# EAGLE design ACS_5.4 (EAGLE 9.6.2)
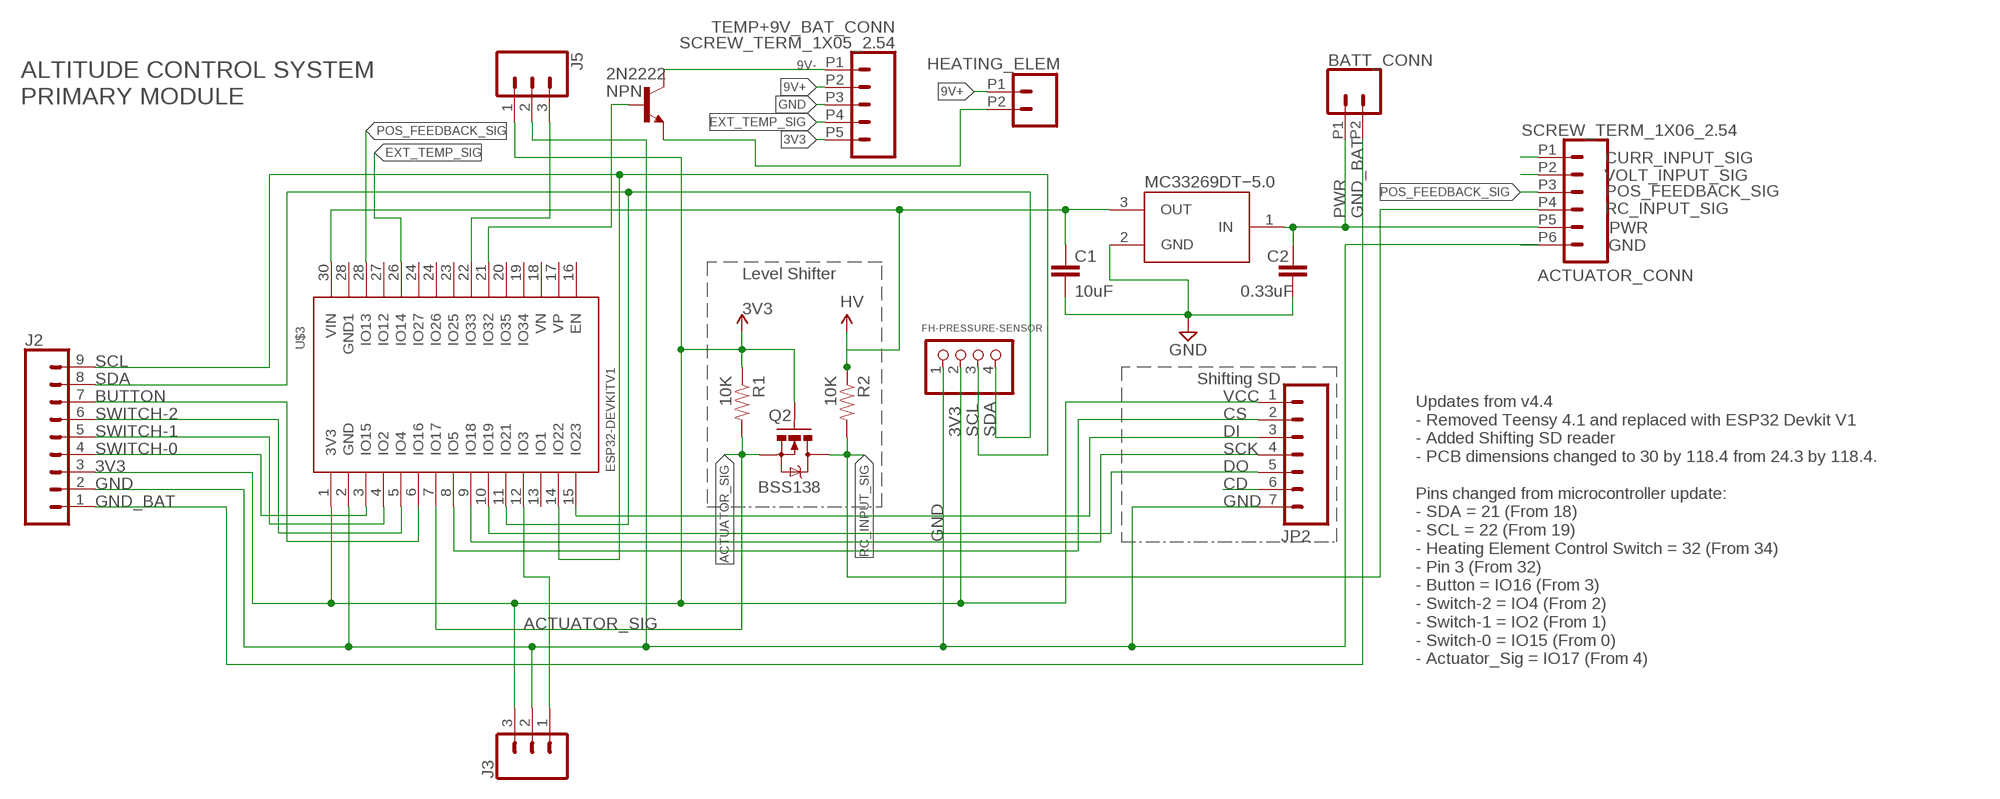
[diagram p0: schematic, sheet 1]

## Parts
2N2222  NPN  NPN_SOT23  [SOT95P237X112-3N]
ACTUATOR_CONN  SCREW_TERM_1X06_2.54  [1X06_2.54_SCREWTERM]
BATT_CONN  CONN_022.54MM_SCREWTERM  [1X02_2.54_SCREWTERM]
C1  10uF  C_CHIP-0603(1608-METRIC)  [CAPC1608X85]
C2  0.33uF  C_CHIP-0603(1608-METRIC)  [CAPC1608X85]
FH-PRESSURE-SENSOR  PINHD-1X4  [1X04]
HEATING_ELEM  CONN_022.54MM_SCREWTERM  [1X02_2.54_SCREWTERM]
J2  CONN_09  [1X09]
J3  CONN_03  [1X03]
J5  CONN_03  [1X03]
JP2  M07  [1X07]
Q2  BSS138  MOSFET-NCHANNELSMD  [SOT23-3]
R1  10K  RESISTOR0603-RES  [0603-RES]
R2  10K  RESISTOR0603-RES  [0603-RES]
TEMP+9V_BAT_CONN  SCREW_TERM_1X05_2.54  [1X05_2.54_SCREWTERM]
U1  MC78M05BDTRKG  [MC78M05BDTRKG]
U$3  ESP32DEVKITV1  [ESP32-DEVKITV1]

## Nets
3V3: FH-PRESSURE-SENSOR.2 J2.3 J3.3 J5.1 JP2.1 Q2.1(G) R1.1 TEMP+9V_BAT_CONN.P5 U$3.1(3V3) ; supply symbol labelled LV
9V+: HEATING_ELEM.P1 TEMP+9V_BAT_CONN.P2
9V-: 2N2222.3(C) TEMP+9V_BAT_CONN.P1
ACTUATOR_SIG: Q2.2(S) R1.2 U$3.7(IO17)
BUTTON: J2.7 U$3.6(IO16)
CURR_INPUT_SIG: ACTUATOR_CONN.P1
EXT_TEMP_SIG: TEMP+9V_BAT_CONN.P4 U$3.26(IO14)
GND: ACTUATOR_CONN.P6 C1.2 C2.2 FH-PRESSURE-SENSOR.1 J2.2 J3.2 J5.2 JP2.7 TEMP+9V_BAT_CONN.P3 U1.2(GND) U$3.2(GND)
GND_BAT: BATT_CONN.P2 J2.1
HV: C1.1 R2.1 U1.3(OUT) U$3.30(VIN)
N$1: J5.3 U$3.22(IO33)
N$5: 2N2222.2(B) U$3.21(IO32)
N$8: JP2.6
N$10: J3.1 U$3.12(IO3)
N$11: JP2.3 U$3.15(IO23)
N$12: JP2.2 U$3.8(IO5)
N$13: JP2.4 U$3.9(IO18)
N$14: JP2.5 U$3.10(IO19)
N$16: 2N2222.1(E) HEATING_ELEM.P2
POS_FEEDBACK_SIG: ACTUATOR_CONN.P3 U$3.28(IO13)
PWR: ACTUATOR_CONN.P5 BATT_CONN.P1 C2.1 U1.1(IN)
RC_INPUT_SIG: ACTUATOR_CONN.P4 Q2.3(D) R2.2
SCL: FH-PRESSURE-SENSOR.3 J2.9 U$3.14(IO22)
SDA: FH-PRESSURE-SENSOR.4 J2.8 U$3.11(IO21)
SWITCH-0: J2.4 U$3.3(IO15)
SWITCH-1: J2.5 U$3.4(IO2)
SWITCH-2: J2.6 U$3.5(IO4)
VOLT_INPUT_SIG: ACTUATOR_CONN.P2
Unconnected: U$3.13(IO1) U$3.16(EN) U$3.17(VP) U$3.18(VN) U$3.19(IO34) U$3.20(IO35) U$3.23(IO25) U$3.24(IO26) U$3.24(IO27) U$3.27(IO12) U$3.28(GND1)

## Notes on the sheet
- Heating Element 
  Control Switch
- ALTITUDE CONTROL SYSTEM
  PRIMARY MODULE
- Actuator Voltage: 7.5 MAX
- MC33269DT−5.0
- Level Shifter
- Shifting SD
- VCC
- CS
- DI
- SCK
- DO
- CD
- Updates from v4.4
  - Removed Teensy 4.1 and replaced with ESP32 Devkit V1
  - Added Shifting SD reader
  - PCB dimensions changed to 30 by 118.4 from 24.3 by 118.4.
  
  Pins changed from microcontroller update:
  - SDA = 21 (From 18)
  - SCL = 22 (From 19)
  - Heating Element Control Switch = 32 (From 34)
  - Pin 3 (From 32)
  - Button = IO16 (From 3)
  - Switch-2 = IO4 (From 2)
  - Switch-1 = IO2 (From 1)
  - Switch-0 = IO15 (From 0)
  - Actuator_Sig = IO17 (From 4)

## Library data of the parts
2N2222 = Transistor:NPN: NPN - Generic; CATEGORY: Transistor; SUB-CATEGORY: BJT; TYPE: NPN
ACTUATOR_CONN = Connectors-Terminal_Block:SCREW_TERM_1X06_2.54
BATT_CONN HEATING_ELEM = SparkFun-Connectors:CONN_02: Multi connection point. Often used as Generic Header-pin footprint for 0.1 inch spaced/style header connections On any of the 0.1 inch spaced packages, you can populate with these: Break Away Headers - Straight <https://www.sparkfun.com/products/116> (PRT-00116) Break Away Male Headers - Right Angle <https://www.sparkfun.com/products/553> (PRT-00553) Female Headers <https://www.sparkfun.com/products/115> (PRT-00115) Break Away Headers - Machine Pin <https://www.sparkfun.com/products/117> (PRT-00117) Break Away Female Headers - Swiss Machine Pin <https://www.sparkfun.com/products/743> (PRT-00743) For SCREWTERMINALS and SPRING TERMINALS visit here: Screw Terimnals on SparkFun.com <https://www.sparkfun.com/search/results?term=Screw+Terminals> (5mm/3.5mm/2.54mm spacing) This device is also useful as a general connection point to wire up your design to another part of your project. Our various solder wires solder well into these plated through hole pads. Hook-Up Wire - Assortment (Stranded, 22 AWG) <https://www.sparkfun.com/products/11375> (PRT-11375) Hook-Up Wire - Assortment (Solid Core, 22 AWG) <https://www.sparkfun.com/products/11367> (PRT-11367) View the entire wire category on our website here <https://www.sparkfun.com/categories/141> Special notes: Molex polarized connector foot print use with: PRT-08233 with associated crimp pins and housings. 2.54_SCREWTERM for use with PRT-10571. 3.5mm Screw Terminal footprints for PRT-08084 5mm Screw Terminal footprints for use with PRT-08432
C1 C2 = Capacitor:C: Capacitor - Generic; CATEGORY: Capacitor
FH-PRESSURE-SENSOR = pinhead:PINHD-1X4: PIN HEADER
J2 = SparkFun-Connectors:CONN_09: Multi connection point. Often used as Generic Header-pin footprint for 0.1 inch spaced/style header connections On any of the 0.1 inch spaced packages, you can populate with these: Break Away Headers - Straight <https://www.sparkfun.com/products/116> (PRT-00116) Break Away Male Headers - Right Angle <https://www.sparkfun.com/products/553> (PRT-00553) Female Headers <https://www.sparkfun.com/products/115> (PRT-00115) Break Away Headers - Machine Pin <https://www.sparkfun.com/products/117> (PRT-00117) Break Away Female Headers - Swiss Machine Pin <https://www.sparkfun.com/products/743> (PRT-00743) For SCREWTERMINALS and SPRING TERMINALS visit here: Screw Terimnals on SparkFun.com <https://www.sparkfun.com/search/results?term=Screw+Terminals> (5mm/3.5mm/2.54mm spacing) This device is also useful as a general connection point to wire up your design to another part of your project. Our various solder wires solder well into these plated through hole pads. Hook-Up Wire - Assortment (Stranded, 22 AWG) <https://www.sparkfun.com/products/11375> (PRT-11375) Hook-Up Wire - Assortment (Solid Core, 22 AWG) <https://www.sparkfun.com/products/11367> (PRT-11367) View the entire wire category on our website here <https://www.sparkfun.com/categories/141> Special notes: Molex polarized connector foot print use with SKU : PRT-08231 with associated crimp pins and housings. 1MM SMD Version SKU: PRT-10208 NOTES ON THE VARIANTS LOCK and LOCK_LONGPADS... This footprint was designed to help hold the alignment of a through-hole component (i.e. 6-pin header) while soldering it into place. You may notice that each hole has been shifted either up or down by 0.005 of an inch from it's more standard position (which is a perfectly straight line). This slight alteration caused the pins (the squares in the middle) to touch the edges of the holes. Because they are alternating, it causes a "brace" to hold the component in place. 0.005 has proven to be the perfect amount of "off-center" position when using our standard breakaway headers. Although looks a little odd when you look at the bare footprint, once you have a header in there, the alteration is very hard to notice. Also,if you push a header all the way into place, it is covered up entirely on the bottom side.
J3 J5 = SparkFun-Connectors:CONN_03: Multi connection point. Often used as Generic Header-pin footprint for 0.1 inch spaced/style header connections On any of the 0.1 inch spaced packages, you can populate with these: Break Away Headers - Straight <https://www.sparkfun.com/products/116> (PRT-00116) Break Away Male Headers - Right Angle <https://www.sparkfun.com/products/553> (PRT-00553) Female Headers <https://www.sparkfun.com/products/115> (PRT-00115) Break Away Headers - Machine Pin <https://www.sparkfun.com/products/117> (PRT-00117) Break Away Female Headers - Swiss Machine Pin <https://www.sparkfun.com/products/743> (PRT-00743) Stackable Header - 3 Pin (Female, 0.1") <https://www.sparkfun.com/products/13875> (PRT-13875) For SCREWTERMINALS and SPRING TERMINALS visit here: Screw Terimnals on SparkFun.com <https://www.sparkfun.com/search/results?term=Screw+Terminals> (5mm/3.5mm/2.54mm spacing) This device is also useful as a general connection point to wire up your design to another part of your project. Our various solder wires solder well into these plated through hole pads. Hook-Up Wire - Assortment (Stranded, 22 AWG) <https://www.sparkfun.com/products/11375> (PRT-11375) Hook-Up Wire - Assortment (Solid Core, 22 AWG) <https://www.sparkfun.com/products/11367> (PRT-11367) View the entire wire category on our website here <https://www.sparkfun.com/categories/141> Special notes: Molex polarized connector foot print use with SKU : PRT-08232 with associated crimp pins and housings.
JP2 = SparkFun-Connectors:M07: Header 7 Standard 7-pin 0.1" header. Use with straight break away headers (SKU : PRT-00116), right angle break away headers (PRT-00553), swiss pins (PRT-00743), machine pins (PRT-00117), and female headers (PRT-00115). NOTES ON THE VARIANTS LOCK and LOCK_LONGPADS... This footprint was designed to help hold the alignment of a through-hole component (i.e. 7-pin header) while soldering it into place. You may notice that each hole has been shifted either up or down by 0.005 of an inch from it's more standard position (which is usually a perfectly straight line). This slight alteration caused the pins (the squares in the middle) to touch the edges of the holes. Because they are alternating, it causes a "brace" to hold the header in place. 0.005 has proven to be the perfect amount of "off-center" position when using our standard breakaway headers. Although looks a little odd when you look at the bare footprint, once you have a header in there, the alteration is very hard to notice. Also, if you push a header all the way into place, it is covered up entirely on the bottom side. This idea of altering the position of holes to aid alignment will be further integrated into the Sparkfun Library for other footprints. It can help hold any component with 3 or more connection pins.
Q2 = SparkFun:MOSFET-NCHANNEL
R1 R2 = SparkFun:RESISTOR: Resistor Basic schematic elements and footprints for 0603, 1206, and PTH resistors.
TEMP+9V_BAT_CONN = Connectors-Terminal_Block:SCREW_TERM_1X05_2.54
U1 = LDO:MC78M05BDTRKG: IC REG LINEAR 5V 500MA DPAK Manufacturer's datasheet <https://www.onsemi.cn/PowerSolutions/document/MC78M00-D.PDF>; CREATED_BY: PCBLayout.com; DIGIKEY_PN: MC78M05BDTRKGOSCT-ND; MANUFACTURER: ON Semiconductor; MPN: IC REG LINEAR 5V 500MA DPAK; PACKAGE: DPak
U$3 = ESP32-DEVKITV1:ESP32DEVKITV1

## Board
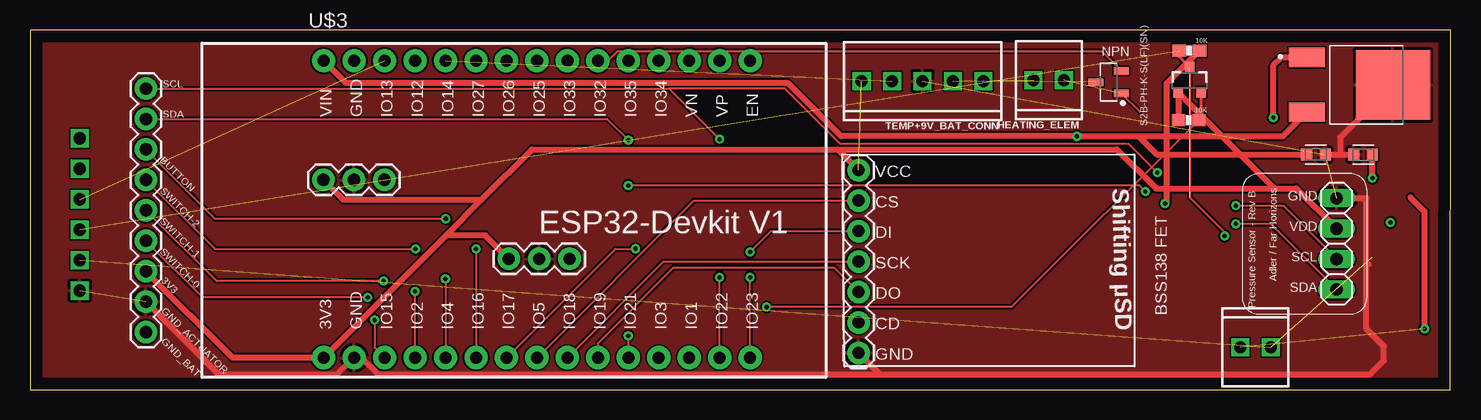
[diagram p1: board, top side]
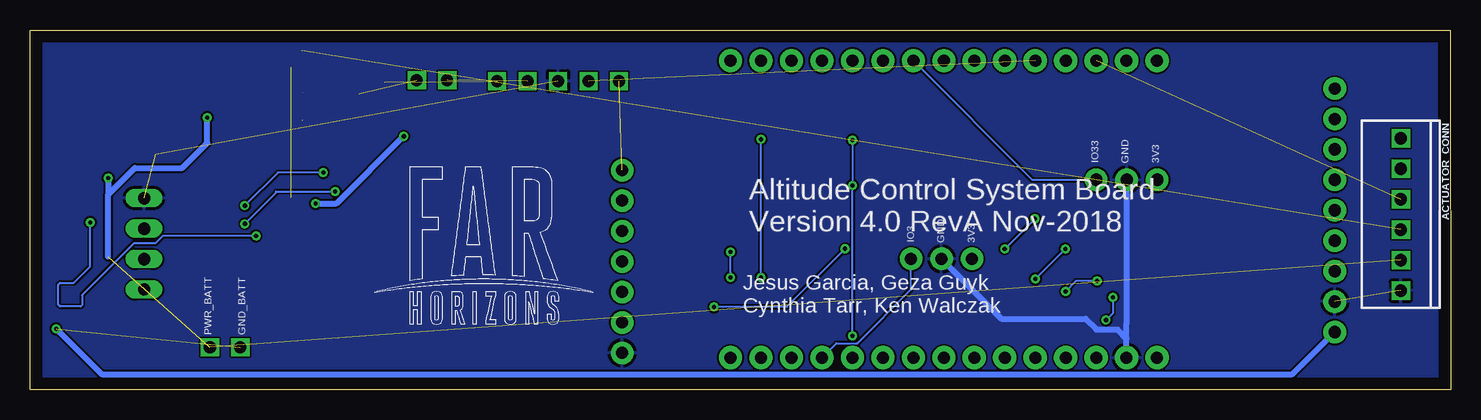
[diagram p2: board, bottom side, seen from below]

Size 118.43 x 30 mm. Coordinates in mm from the lower left corner, seen from the top.
Outline: 0,0 118.4,0 118.43,30 0.03,30 0,0
Copper layers (1*16): Top 0.035mm / dielectric 1.5mm / Bottom 0.035mm
Design rules "default": minimum track width 6mil, minimum drill 0.35mm, track to track 6mil, track to pad 6mil, pad to pad 6mil, via to via 6mil, smd to smd 6mil, copper to edge 40mil, drill to drill 6mil, minimum pad ring 10mil, minimum via ring 8mil, stop-mask expansion 4mil, vias tented up to drill 0mil, thermal gap 10mil

### Footprints (pad centres in the part's own frame; a part is rotated, then mirrored left to right if it is on the bottom)
SOT95P237X112-3N = smd 1.224 x 0.625: 1 -1.064,0.95; 2 -1.064,-0.95; 3 1.064,0
1X06_2.54_SCREWTERM = drill 1.016 square: P1 0,0; P2 2.54,0; P3 5.08,0; P4 7.62,0; P5 10.16,0; P6 12.7,0
1X02_2.54_SCREWTERM = drill 1.016 square: P1 2.54,0; P2 0,0
CAPC1608X85 = smd 0.921 x 0.97: 1 -0.775,0; 2 0.775,0
1X04 = drill 1.016 long: 1 -3.81,0; 2 -1.27,0; 3 1.27,0; 4 3.81,0
1X09 = drill 1.016 pad 1.88: 1 0,0; 2 2.54,0; 3 5.08,0; 4 7.62,0; 5 10.16,0; 6 12.7,0; 7 15.24,0; 8 17.78,0; 9 20.32,0
1X03 = drill 1.016 pad 1.88: 1 0,0; 2 2.54,0; 3 5.08,0
1X07 = drill 1.016 pad 1.88: 1 0,0; 2 2.54,0; 3 5.08,0; 4 7.62,0; 5 10.16,0; 6 12.7,0; 7 15.24,0
SOT23-3 = smd 0.8 x 0.9: 1 -0.95,-1; 2 0.95,-1; 3 0,1.1
0603-RES = smd 1.1 x 1: 1 -0.85,0; 2 0.85,0
1X05_2.54_SCREWTERM = drill 1.016 square: P1 0,0; P2 2.54,0; P3 5.08,0; P4 7.62,0; P5 10.16,0
MC78M05BDTRKG = smd 1.6 x 3: 1 -2.285,-4.08; 3 2.285,-4.08 | smd 5.8 x 6.2: 2 0,3.1
ESP32-DEVKITV1 = drill 1 pad 1.93: 1 -22.87,-13.54; 2 -20.33,-13.54; 3 -17.79,-13.54; 4 -15.25,-13.54; 5 -12.71,-13.54; 6 -10.17,-13.54; 7 -7.63,-13.54; 8 -5.09,-13.54; 9 -2.55,-13.54; 10 -0.01,-13.54; 11 2.53,-13.54; 12 5.07,-13.54; 13 7.61,-13.54; 14 10.15,-13.54; 15 12.69,-13.54; 16 12.69,11.23; 17 10.15,11.23; 18 7.61,11.23; 19 5.07,11.23; 20 2.53,11.23; 21 -0.01,11.23; 22 -2.55,11.23; 23 -5.09,11.23; 24 -7.63,11.23; 25 -10.17,11.23; 26 -12.71,11.23; 27 -15.25,11.23; 28 -17.79,11.23; 29 -20.33,11.23; 30 -22.87,11.23

### Placement (x,y rotation side)
2N2222  89.92,25.64 180 top
ACTUATOR_CONN  4.15,20.95 270 bottom
BATT_CONN  100.9,3.53 0 top
C1  107.19,19.61 0 top
C2  111.13,19.6 180 top
FH-PRESSURE-SENSOR  108.92,12.15 270 top
HEATING_ELEM  86.19,25.81 180 top
J2  9.66,4.79 90 top
J3  44.98,10.9 180 top
J5  24.46,17.5 0 top
JP2  69.07,18.3 270 top
Q2  96.67,25.79 0 top
R1  96.58,22.48 0 top
R2  96.64,28.28 180 top
TEMP+9V_BAT_CONN  79.48,25.73 180 top
U1  110.51,25.42 270 top
U$3  47.34,16.2 0 top

### Tracks (layer width: path | path; a pad name or v marks a point on that pad's centre or on a via)
3V3  (3 unrouted)
  Top 0.152: R1.1
  Top 0.254: 95.7,24.81 Q2.1
  Top 0.508: J2.3 16.88,2.65 U$3.1 34.67,12.86 | 34.67,12.86 37.66,15.85 | 37.66,15.85 41.84,20.03 67.34,20.03 | JP2.1 67.34,20.03 | 67.34,20.03 90.6,20.03 93.84,16.79 93.84,16.78 103.72,16.78 | 103.72,16.78 105.56,16.78 FH-PRESSURE-SENSOR.2 | R1.1 | 95.71,24.78 95.71,22.49 | J5.1 26.11,15.85 37.66,15.85 | J3.3 37.94,12.86 34.67,12.86 | 103.72,16.78 95.7,24.81
9V+  (1 unrouted)
9V-  (1 unrouted)
ACTUATOR_SIG  (via drill 0.35)
  Top 0.152: 97.5,22.55 R1.2 81.83,6.88 v61.41,6.88 | U$3.7 48.8,11.75 v50.48,11.75
  Top 0.254: Q2.2 97.62,22.67 97.5,22.55
  Bottom 0.152: v50.48,11.75 55.35,6.88 v61.41,6.88
BUTTON  (via drill 0.35)
  Top 0.152: v37.17,11.74 U$3.6 | v34.66,14.25 15.44,14.25 J2.7
  Bottom 0.152: v34.66,14.25 v37.17,11.74
EXT_TEMP_SIG  (1 unrouted)
GND  (3 unrouted)
  Top 0.508: C1.2 109.22,19.61 | 109.22,19.61 110.34,19.61 C2.2 | 109.22,19.61 109.22,21.03 U1.2 | J2.2 15.73,1.27 25.62,1.27 U$3.2 27.61,2.67 29.01,1.27 70.86,1.27 | 70.86,1.27 111.7,1.27 112.86,2.43 112.86,3.6 111.4,5.06 111.4,10.61 | JP2.7 70.86,1.27 | 111.56,10.45 111.4,10.61 | 111.4,10.61 111.4,15.95 111.39,15.96 FH-PRESSURE-SENSOR.1
  Bottom 0.508: U$3.2 27.02,4.25 | 27.02,4.25 27.02,5.51 27,5.53 J5.2 | J3.2 37.43,5.9 30.44,5.9 29.55,5.01 27.77,5.01 27.02,4.25
  pour Top: -4.15,31.64 -4.15,-1.81 119.4,-1.81 119.4,31.64
  pour Bottom: -5.76,31.6 -5.76,-1.75 119.61,-1.75 119.61,31.6
GND_BAT  (via drill 0.35)  (1 unrouted)
  Top 0.508: 115.07,16.04 116.25,14.86 v116.25,5.07 v116.25,5.06
  Bottom 0.508: v116.25,5.06 112.46,1.27 13.18,1.27 J2.1
HV  (via drill 0.35)
  Top 0.508: 24.48,27.43 26.31,25.6 63.13,25.6 67.61,21.13 v87.27,21.13 92.41,21.13 | 24.48,27.43 | U$3.30 24.48,27.43 | v94.62,15.52 94.75,15.65 94.75,25.53 R2.1 | 92.41,21.13 93.93,19.61 C1.1 | 92.41,21.13 104.42,21.13 U1.3
  Bottom 0.508: v94.62,15.52 92.88,15.52 v87.27,21.13
N$1
  Bottom 0.152: J5.3 34.86,17.5 U$3.22
N$5
  Top 0.152: U$3.21 48.19,27.43 48.97,28.22 89.36,28.22 2N2222.2
N$10
  Bottom 0.152: U$3.12 51.22,3.86 49.46,3.86 44.98,8.35 J3.1
N$11  (via drill 0.35)
  Top 0.152: U$3.15 v60.03,9.35 | v60.03,11.48 61.77,13.22 JP2.3
  Bottom 0.152: v60.03,9.35 v60.03,11.48
N$12
  Top 0.152: U$3.8 55.35,15.76 JP2.2
N$13
  Top 0.152: U$3.9 52.81,10.68 JP2.4
N$14
  Top 0.152: U$3.10 47.34,3.85 53.61,10.13 67.08,10.13 JP2.5
N$16  (1 unrouted)
  Top 0.152: 2N2222.1 92.5,23.17
POS_FEEDBACK_SIG  (1 unrouted)
PWR  (via drill 0.35)  (2 unrouted)
  Top 0.508: v111.91,17.65 C2.1 | U1.1 104.3,27.7 103.65,27.06 v103.65,22.68
  Bottom 0.508: 111.91,11.07 111.91,16.27 | v111.91,17.65 111.91,16.27 | 111.91,16.27 109.69,18.49 105.74,18.49 103.65,20.58 v103.65,22.68
RC_INPUT_SIG  (via drill 0.35)  (2 unrouted)
  Top 0.152: Q2.3 96.67,16.01 99.59,13.1 v99.59,12.82
  Top 0.254: R2.2 95.79,27.77 Q2.3
  Bottom 0.152: v99.59,12.82 107.36,12.82 107.98,12.2 109.76,12.2 114.08,7.89 114.08,7.05 114.21,6.92 115.93,6.92 116.06,7.05 116.06,8.76 115.93,8.9 114.77,8.9 113.41,10.26 v113.41,13.94
SCL  (via drill 0.35)
  Top 0.152: U$3.14 v57.49,9.35 v57.49,9.36 | J2.9 53.25,25.11 | 53.25,25.11 v57.49,20.88 | v93.98,18.11 91.56,20.52 67.53,20.52 62.94,25.11 53.25,25.11 | v100.52,15.34 104.46,15.34 FH-PRESSURE-SENSOR.3
  Bottom 0.152: v93.98,18.11 97.75,18.11 v100.52,15.34 | v57.49,9.36 v57.49,20.88
SDA  (via drill 0.35)
  Top 0.152: J2.8 48.12,22.57 | v92.98,16.53 92.48,17.03 v49.88,17.03 | FH-PRESSURE-SENSOR.4 103.43,13.83 v100.52,13.83 | v49.88,20.82 48.12,22.57 | 48.12,22.57 | U$3.11 v49.88,4.49
  Bottom 0.152: v100.52,13.83 97.91,16.44 97.91,16.53 v92.99,16.53 v92.98,16.53 | v49.88,20.82 v49.88,17.03 v49.88,4.49
SWITCH-0  (via drill 0.35)
  Top 0.152: v28.16,7.7 14.38,7.7 J2.4 | v28.73,5.8 28.71,5.79 28.71,3.5 U$3.3
  Bottom 0.152: v28.73,5.8 28.18,6.34 28.18,7.68 v28.16,7.7
SWITCH-1  (via drill 0.35)
  Top 0.152: v29.47,9.06 15.55,9.06 J2.5 | U$3.4 v32.09,8.19
  Bottom 0.152: v29.47,9.06 31.23,9.06 v32.09,8.19
SWITCH-2  (via drill 0.35)
  Top 0.152: v34.62,9.23 34.62,2.67 U$3.5 | J2.6 15.43,11.72 v32.13,11.72
  Bottom 0.152: v34.62,9.23 v32.13,11.72

### Text on the board
tPlace: Shifting µSD
bPlace: Altitude Control System Board / Version 4.0 RevA Nov-2018 | Jesus Garcia, Geza Guyk / Cynthia Tarr, Ken Walczak
tNames: 10K | NPN | SCL | SDA | 10K | S2B-PH-K-S(LF)(SN) | BUTTON | VCC | SWITCH-2 | Pressure Sensor - Rev B | Adler / Far Horizons | GND | CS | SWITCH-1 | VDD | DI | SWITCH-0 | SCL | SCK | 3V3 | SDA | DO | GND_ACTUATOR | BSS138 FET | CD | GND_BAT | GND
bNames: GND | IO33 | 3V3 | 3V3 | GND | IO3 | GND_BATT | PWR_BATT
tValues: 10uF | 0.33uF